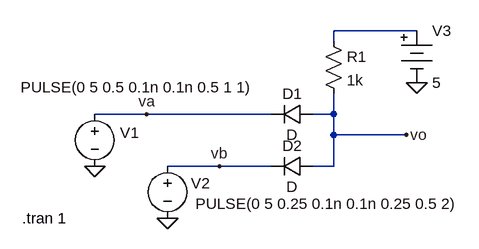
[diagram p0: schematic compuerta AND.asc]
compuerta AND.asc, the LTspice schematic file:
Version 4
SHEET 1 880 680
WIRE 448 -80 320 -80
WIRE 320 -64 320 -80
WIRE 32 48 -48 48
WIRE 224 48 32 48
WIRE 320 48 320 16
WIRE 320 48 288 48
WIRE 320 80 320 48
WIRE 432 80 320 80
WIRE 144 128 64 128
WIRE 224 128 144 128
WIRE 320 128 320 80
WIRE 320 128 288 128
FLAG -48 128 0
FLAG 64 208 0
FLAG 448 0 0
FLAG 32 48 va
FLAG 144 128 vb
FLAG 432 80 vo
SYMBOL voltage -48 32 R0
WINDOW 0 39 45 Left 2
WINDOW 3 -114 -25 Left 2
WINDOW 123 0 0 Left 0
WINDOW 39 0 0 Left 0
SYMATTR InstName V1
SYMATTR Value PULSE(0 5 0.5 0.1n 0.1n 0.5 1 1)
SYMBOL voltage 64 112 R0
WINDOW 0 36 42 Left 2
WINDOW 3 43 74 Left 2
WINDOW 123 0 0 Left 0
WINDOW 39 0 0 Left 0
SYMATTR InstName V2
SYMATTR Value PULSE(0 5 0.25 0.1n 0.1n 0.25 0.5 2)
SYMBOL diode 288 32 R90
WINDOW 0 0 32 VBottom 2
WINDOW 3 32 32 VTop 2
SYMATTR InstName D1
SYMBOL diode 288 112 R90
WINDOW 0 0 32 VBottom 2
WINDOW 3 32 32 VTop 2
SYMATTR InstName D2
SYMBOL res 304 -80 R0
SYMATTR InstName R1
SYMATTR Value 1k
SYMBOL Misc\\battery 448 -96 R0
WINDOW 123 0 0 Left 0
WINDOW 39 0 0 Left 0
SYMATTR InstName V3
SYMATTR Value 5
TEXT -160 208 Left 2 !.tran 1

The netlist it stands for:
* compuerta AND.asc
V1 va 0 PULSE(0 5 0.5 0.1n 0.1n 0.5 1 1)
V2 vb 0 PULSE(0 5 0.25 0.1n 0.1n 0.25 0.5 2)
D1 vo va D
D2 vo vb D
R1 N001 vo 1k
V3 N001 0 5
.model D D
.lib standard.dio
.tran 1
.backanno
.end